# Altium schematic sheet ComboLogic.SchDoc
size A; SheetNumber: 2; SheetTotal: 3
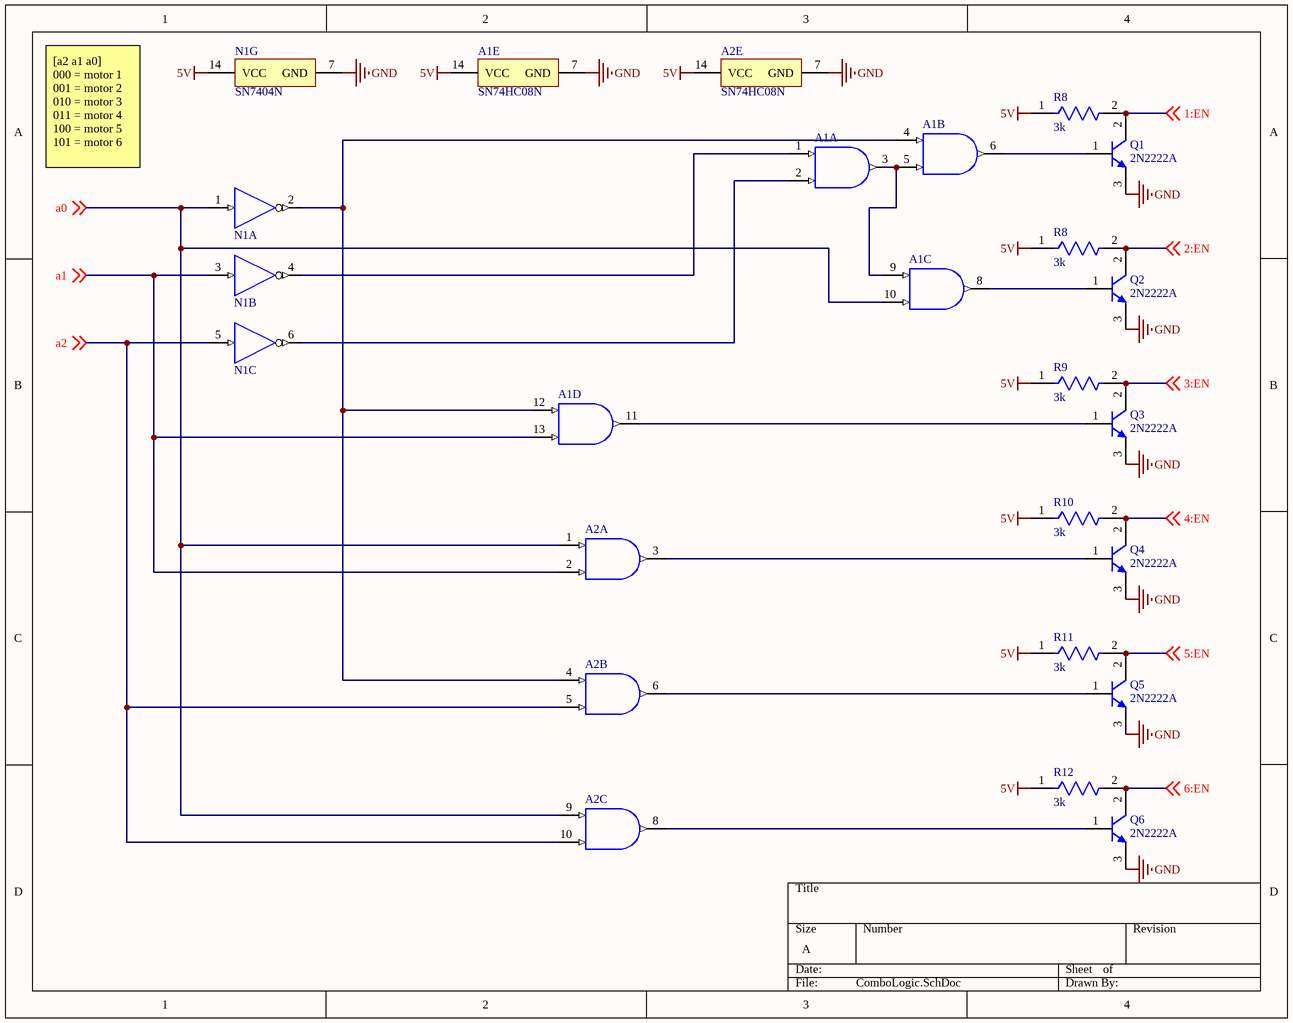
[diagram p0: ComboLogic.SchDoc]

## Parts
(Parts that share a designator on the sheet are numbered #1, #2 ... from top to bottom, then left to right.)
A1  SN74HC08N  [N0014A]  (value not drawn)  (parts A,B,C,D,E of 5)
A2  SN74HC08N  [N0014A]  (value not drawn)  (parts A,B,C,E of 5)
N1  SN7404N  [N0014A]  (value not drawn)  (parts A,B,C,G of 7)
Q1  2N2222A  [STM-TO-18-3]
Q2  2N2222A  [STM-TO-18-3]
Q3  2N2222A  [STM-TO-18-3]
Q4  2N2222A  [STM-TO-18-3]
Q5  2N2222A  [STM-TO-18-3]
Q6  2N2222A  [STM-TO-18-3]
R8#1  3k  [FP-RR1220-IPC_B]
R8#2  3k  [FP-RR1220-IPC_B]
R9  3k  [FP-RR1220-IPC_B]
R10  3k  [FP-RR1220-IPC_B]
R11  3k  [FP-RR1220-IPC_B]
R12  3k  [FP-RR1220-IPC_B]

## Nets
5V: A1.14(VCC) A2.14(VCC) N1.14(VCC) R8#1.1 R8#2.1 R9.1 R10.1 R11.1 R12.1
GND: A1.7(GND) A2.7(GND) N1.7(GND) Q1.3(E) Q2.3(E) Q3.3(E) Q4.3(E) Q5.3(E) Q6.3(E)
1:EN: Q1.2(C) R8#1.2 ; off-sheet 1:EN
2:EN: Q2.2(C) R8#2.2 ; off-sheet 2:EN
3:EN: Q3.2(C) R9.2 ; off-sheet 3:EN
4:EN: Q4.2(C) R10.2 ; off-sheet 4:EN
5:EN: Q5.2(C) R11.2 ; off-sheet 5:EN
6:EN: Q6.2(C) R12.2 ; off-sheet 6:EN
a0: A1.10(3B) A2.1(1A) A2.9(3A) N1.1(1A) ; off-sheet a0
a1: A1.13(4B) A2.2(1B) N1.3(2A) ; off-sheet a1
a2: A2.5(2B) A2.10(3B) N1.5(3A) ; off-sheet a2
NetA1_1: A1.1(1A) N1.4(~{2Y})
NetA1_2: A1.2(1B) N1.6(~{3Y})
NetA1_3: A1.3(1Y) A1.5(2B) A1.9(3A)
NetA1_4: A1.4(2A) A1.12(4A) A2.4(2A) N1.2(~{1Y})
NetA1_6: A1.6(2Y) Q1.1(B)
NetA1_8: A1.8(3Y) Q2.1(B)
NetA1_11: A1.11(4Y) Q3.1(B)
NetA2_3: A2.3(1Y) Q4.1(B)
NetA2_6: A2.6(2Y) Q5.1(B)
NetA2_8: A2.8(3Y) Q6.1(B)

## Notes on the sheet
- [a2 a1 a0]
  000 = motor 1
  001 = motor 2
  010 = motor 3
  011 = motor 4
  100 = motor 5
  101 = motor 6

## Library data of the parts
A1 A2 = CMP-0777-00250-3: Quadruple 2-Input Positive-AND Gates, N0014A, TUBE; Manufacturer: Texas Instruments; Output Type: CMOS; ICC @ Nom Voltage(Max)(mA): 0.02; tpd @ Nom Voltage(Max)(ns): 28; Voltage(Nom)(V): 5; VCC(Min)(V): 2; Technology Family: HC; F @ Nom Voltage(Max)(Mhz): 70; Rating: Catalog; Bits(#): 4; Schmitt Trigger: No; VCC(Max)(V): 6; PackageReference: N0014A; Input Type: CMOS; Generic Part Number: SN74HC08; DatasheetVersion: SCLS081F; Operating Temperature Range(C): -40 to 85
N1 = CMP-1615-00872-2: Hex inverters, N0014A, TUBE; Generic Part Number: SN7404; Manufacturer: Texas Instruments; Voltage(Nom)(V): 5; Bits(#): 6; tpd @ Nom Voltage(Max)(ns): 22; Schmitt Trigger: No; VCC(Max)(V): 5.25; ICC @ Nom Voltage(Max)(mA): 0.033; Technology Family: TTL; Rating: Catalog; F @ Nom Voltage(Max)(Mhz): 35; Output Type: CMOS; VCC(Min)(V): 4.75; Output Drive (IOL/IOH)(Max)(mA): -0.4/16; DatasheetVersion: SDLS029C; Code_JEDEC: MS-001; Operating Temperature Range(C): 0 to 70; PackageReference: N0014A; Input Type: TTL
Q1-Q6 = CMP-2000-05381-1: High Speed Switch, 0.6 A IC, -65 to 175 degC, 3-Pin TO-18, RoHS, Bulk; Manufacturer: STMicroelectronics; Power Dissipation Pd: 500mW; DC Current Gain hFE: 300hFE; Transistor Polarity: NPN; DC Collector Current: 600mA; No. of Pins: 3Pins; Transition Frequency ft: 300MHz; Collector Emitter Voltage V(br)ceo: 40V; Product Range: -; Package Reference: TO-18-3; Datasheet URL: https://datasheet.ciiva.com/25917/cd00003223-25917094.pdf; Automotive Qualification Standard: -; Transistor Case Style: TO-18; Operating Temperature Max: 175degC; Datasheet Version: Feb-03; Package Description: 3-Pin Through Hole Device, Dia 5.8 mm, Pitch 1.27 mm; Manufacturer URL: http://www.st.com/
R8#1 R8#2 R9-R12 = CMP-2001-03369-2: 3kΩ ±0.5% 0.1W 1/10W Chip Resistor 0805 (2012 Metric) Thin Film; Temperature Coefficient: 25ppm/°C; Voltage Rating: 100V; Max Power Dissipation: 100mW; Resistance: 3kR; Min Operating Temperature: -55°C; Resistor Type: Thin Film; Mount: Surface Mount; Case Code (Imperial): 0805; Technology: THIN FILM; Length: 2mm; Voltage Rating (DC): 100V; Case/Package: 0805; Depth: 1.25mm; Lead Free: Lead Free; Packaging: Tape and Reel; Series: RR; Termination: SMD/SMT; Tolerance: 0.5%; Package Quantity: 1; Max Operating Temperature: 125°C; RoHS Compliant: Yes; Width: 0.049inch; Height: 0.4mm; Number of Terminations: 2; Case Code (Metric): 2012; Size Code: 0805; Number of Pins: 2; Power Rating: 100mW